# Altium schematic sheet rectangle11board.SchDoc
size A; SheetNumber: 1; SheetTotal: 1
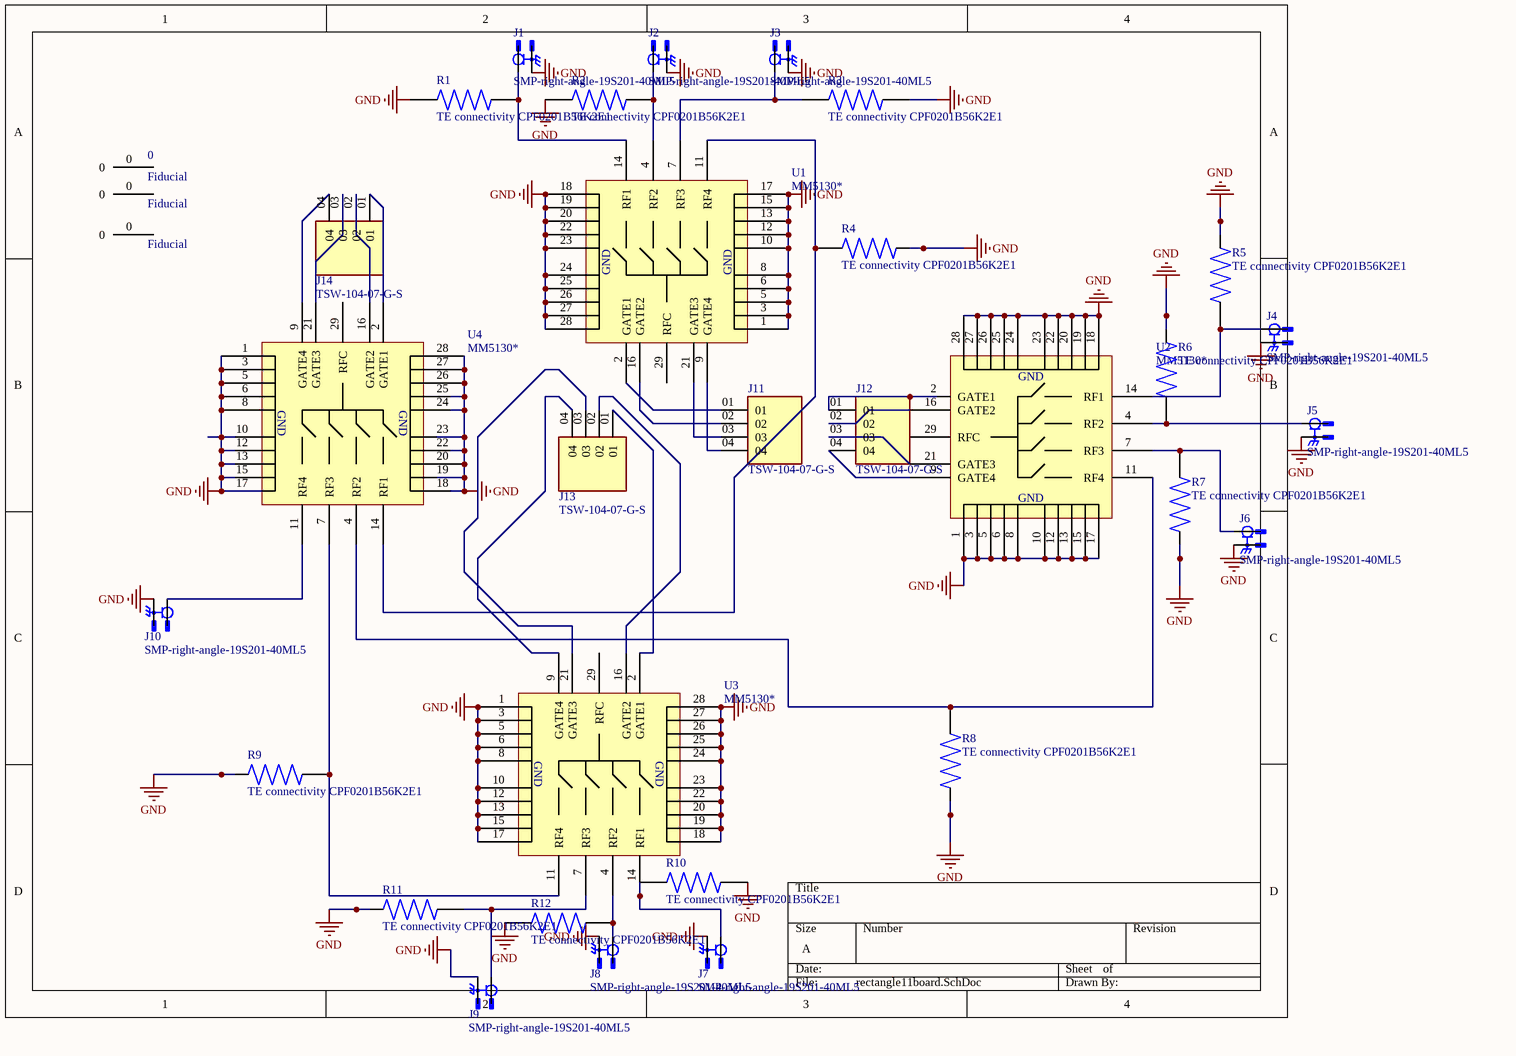
[diagram p0: rectangle11board.SchDoc]

## Parts
(Parts that share a designator on the sheet are numbered #1, #2 ... from top to bottom, then left to right.)
0  Fiducial  [fiducial]
?#1  Fiducial  [fiducial]
?#2  Fiducial  [fiducial]
J1  SMP-right-angle-19S201-40ML5  [rosenberger-19S201-40ML5]
J2  SMP-right-angle-19S201-40ML5  [rosenberger-19S201-40ML5]
J3  SMP-right-angle-19S201-40ML5  [rosenberger-19S201-40ML5]
J4  SMP-right-angle-19S201-40ML5  [rosenberger-19S201-40ML5]
J5  SMP-right-angle-19S201-40ML5  [rosenberger-19S201-40ML5]
J6  SMP-right-angle-19S201-40ML5  [rosenberger-19S201-40ML5]
J7  SMP-right-angle-19S201-40ML5  [rosenberger-19S201-40ML5]
J8  SMP-right-angle-19S201-40ML5  [rosenberger-19S201-40ML5]
J9  SMP-right-angle-19S201-40ML5  [rosenberger-19S201-40ML5]
J10  SMP-right-angle-19S201-40ML5  [rosenberger-19S201-40ML5]
J11  TSW-104-07-G-S  [SAMTEC_TSW-104-07-G-S]
J12  TSW-104-07-G-S  [SAMTEC_TSW-104-07-G-S]
J13  TSW-104-07-G-S  [SAMTEC_TSW-104-07-G-S]
J14  TSW-104-07-G-S  [SAMTEC_TSW-104-07-G-S]
R1  TE connectivity CPF0201B56K2E1  [0201-resistor]
R2  TE connectivity CPF0201B56K2E1  [0201-resistor]
R3  TE connectivity CPF0201B56K2E1  [0201-resistor]
R4  TE connectivity CPF0201B56K2E1  [0201-resistor]
R5  TE connectivity CPF0201B56K2E1  [0201-resistor]
R6  TE connectivity CPF0201B56K2E1  [0201-resistor]
R7  TE connectivity CPF0201B56K2E1  [0201-resistor]
R8  TE connectivity CPF0201B56K2E1  [0201-resistor]
R9  TE connectivity CPF0201B56K2E1  [0201-resistor]
R10  TE connectivity CPF0201B56K2E1  [0201-resistor]
R11  TE connectivity CPF0201B56K2E1  [0201-resistor]
R12  TE connectivity CPF0201B56K2E1  [0201-resistor]
U1  MM5130*  [MM5130-NORM_PCB_NOFLOOD]
U2  MM5130*  [MM5130-NORM_PCB_NOFLOOD]
U3  MM5130*  [MM5130-NORM_PCB_NOFLOOD]
U4  MM5130*  [MM5130-NORM_PCB_NOFLOOD]

## Nets
GND: J1.gnd J2.gnd J3.gnd J4.gnd J5.gnd J6.gnd J7.gnd J8.gnd J9.gnd J10.gnd R1.2 R2.2 R3.1 R4.1 R5.1 R6.1 R7.2 R8.2 R9.2 R10.1 R11.2 R12.2 U1.1(GND) U1.3(GND) U1.5(GND) U1.6(GND) U1.8(GND) U1.10(GND) U1.12(GND) U1.13(GND) U1.15(GND) U1.17(GND) U1.18(GND) U1.19(GND) U1.20(GND) U1.22(GND) U1.23(GND) U1.24(GND) U1.25(GND) U1.26(GND) U1.27(GND) U1.28(GND) U2.1(GND) U2.3(GND) U2.5(GND) U2.6(GND) U2.8(GND) U2.10(GND) U2.12(GND) U2.13(GND) U2.15(GND) U2.17(GND) U2.18(GND) U2.19(GND) U2.20(GND) U2.22(GND) U2.23(GND) U2.24(GND) U2.25(GND) U2.26(GND) U2.27(GND) U2.28(GND) U3.1(GND) U3.3(GND) U3.5(GND) U3.6(GND) U3.8(GND) U3.10(GND) U3.12(GND) U3.13(GND) U3.15(GND) U3.17(GND) U3.18(GND) U3.19(GND) U3.20(GND) U3.22(GND) U3.23(GND) U3.24(GND) U3.25(GND) U3.26(GND) U3.27(GND) U3.28(GND) U4.1(GND) U4.3(GND) U4.5(GND) U4.6(GND) U4.8(GND) U4.10(GND) U4.12(GND) U4.13(GND) U4.15(GND) U4.17(GND) U4.18(GND) U4.19(GND) U4.20(GND) U4.22(GND) U4.23(GND) U4.24(GND) U4.25(GND) U4.26(GND) U4.27(GND) U4.28(GND)
NetJ1_1: J1.1 R1.1 U1.14(RF1)
NetJ2_1: J2.1 R2.1 U1.4(RF2)
NetJ3_1: J3.1 R3.2 U1.7(RF3)
NetJ4_1: J4.1 R5.2 U2.14(RF1)
NetJ5_1: J5.1 R6.2 U2.4(RF2)
NetJ6_1: J6.1 R7.1 U2.7(RF3)
NetJ7_1: J7.1 R10.2 U3.14(RF1)
NetJ8_1: J8.1 R12.1 U3.4(RF2)
NetJ9_1: J9.1 R11.1 U3.7(RF3)
NetJ10_1: J10.1 U4.11(RF4)
NetJ11_01: J11.01 U1.2(GATE1)
NetJ11_02: J11.02 U1.16(GATE2)
NetJ11_03: J11.03 U1.21(GATE3)
NetJ11_04: J11.04 U1.9(GATE4)
NetJ12_01: J12.01 U2.2(GATE1)
NetJ12_02: J12.02 U2.16(GATE2)
NetJ12_03: J12.03 U2.21(GATE3)
NetJ12_04: J12.04 U2.9(GATE4)
NetJ13_01: J13.01 U3.2(GATE1)
NetJ13_02: J13.02 U3.16(GATE2)
NetJ13_03: J13.03 U3.21(GATE3)
NetJ13_04: J13.04 U3.9(GATE4)
NetJ14_01: J14.01 U4.2(GATE1)
NetJ14_02: J14.02 U4.16(GATE2)
NetJ14_03: J14.03 U4.21(GATE3)
NetJ14_04: J14.04 U4.9(GATE4)
NetR4_2: R4.2 U1.11(RF4) U4.14(RF1)
NetR8_1: R8.1 U2.11(RF4) U4.4(RF2)
NetR9_1: R9.1 U3.11(RF4) U4.7(RF3)

Not connected (* = marked no-connect by the designer): 0 0; ?#1 0; ?#2 0; U1 29(RFC); U2 29(RFC); U3 29(RFC); U4 29(RFC)

## Library data of the parts
J1-J10 = SMP-right-angle-19S201-40ML5: SMOOTH BORE SMP Connector Plug, Male Pin 50Ohm Surface Mount Solder; MP: 853050232; MF: Molex; Check_prices: https://www.snapeda.com/parts/853050232/Molex/view-part/?ref=eda; Value: *; Availability: In Stock; Price: None; Package: None; SnapEDA_Link: https://www.snapeda.com/parts/853050232/Molex/view-part/?ref=snap; Purchase-URL: https://pricing.snapeda.com/search/part/853050232/?ref=eda; Supplier 1: Mouser; Supplier Part Number 1: 476-19S201-40ML5
J11-J14 = TSW-104-07-G-S: <a href="https://pricing.snapeda.com/parts/TSW-104-07-G-S/Samtec/view-part?ref=eda">Check availability</a>; MP: altium_native_batch; Package: None; Price: None; Value: *; Availability: Unavailable
R1-R12 = TE connectivity CPF0201B56K2E1: CPF 0201 56K2 0.1% 25PPM 1K RL; MP: ERJ1GN0R00C; Value: 56k; Availability: Unavailable; Price: None; Package: None; Mfgr: TE connectivity; Mfgr Part No.: CPF0201B56K2E1
U1-U4 = IC-MM5130: High power SP4T MEMs switch